# Altium schematic sheet MotorSheet.SchDoc
size A; SheetNumber: 2; SheetTotal: 4
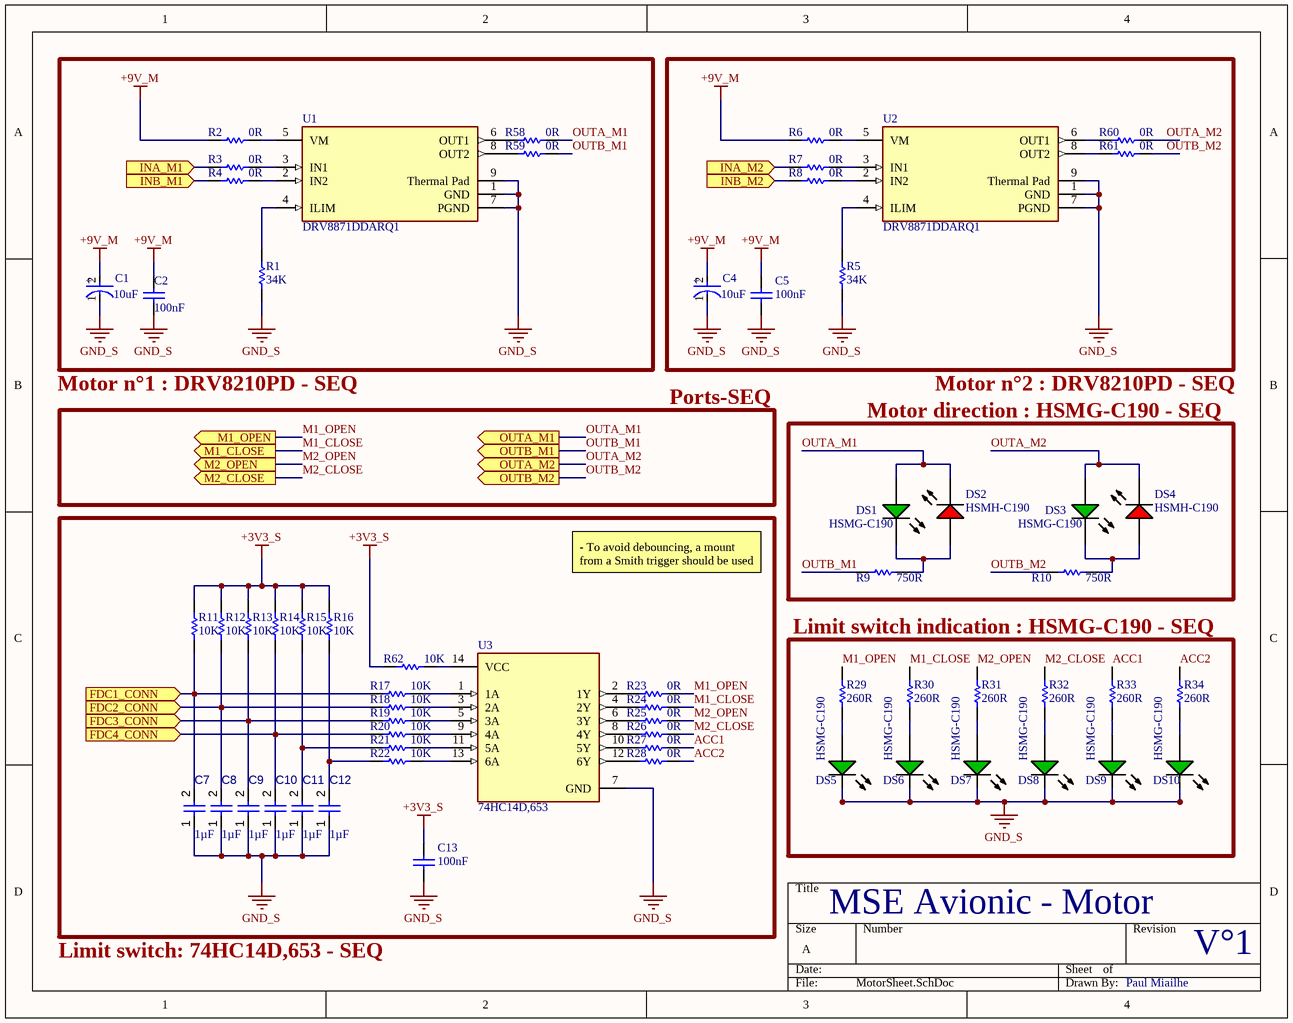
[diagram p0: MotorSheet.SchDoc]

## Parts
C1  Capacitance: 10uF  [FP-SC-MFG]  (hidden comment: EEE1VA100SR)
C2  Capacitance: 100nF  [CAPC2013X135X45ML10T25]  (hidden comment: GRM21BR71H104KA01L)
C4  Capacitance: 10uF  [FP-SC-MFG]  (hidden comment: EEE1VA100SR)
C5  Capacitance: 100nF  [CAPC2013X135X45ML10T25]  (hidden comment: GRM21BR71H104KA01L)
C7  value 1µF  [CAPC0603(1608)100_L]  (hidden comment: Capacitor 1µF +/-0.1% 25V 0603)
C8  value 1µF  [CAPC0603(1608)100_L]  (hidden comment: Capacitor 1µF +/-0.1% 25V 0603)
C9  value 1µF  [CAPC0603(1608)100_L]  (hidden comment: Capacitor 1µF +/-0.1% 25V 0603)
C10  value 1µF  [CAPC0603(1608)100_L]  (hidden comment: Capacitor 1µF +/-0.1% 25V 0603)
C11  value 1µF  [CAPC0603(1608)100_L]  (hidden comment: Capacitor 1µF +/-0.1% 25V 0603)
C12  value 1µF  [CAPC0603(1608)100_L]  (hidden comment: Capacitor 1µF +/-0.1% 25V 0603)
C13  Capacitance: 100nF  [CAPC2013X135X45ML10T25]  (hidden comment: GRM21BR71H104KA01L)
DS1  HSMG-C190  [AVAG-HSMX-C190_V]
DS2  HSMH-C190  [AVAG-HSMX-C190_V]
DS3  HSMG-C190  [AVAG-HSMX-C190_V]
DS4  HSMH-C190  [AVAG-HSMX-C190_V]
DS5  HSMG-C190  [AVAG-HSMX-C190_V]
DS6  HSMG-C190  [AVAG-HSMX-C190_V]
DS7  HSMG-C190  [AVAG-HSMX-C190_V]
DS8  HSMG-C190  [AVAG-HSMX-C190_V]
DS9  HSMG-C190  [AVAG-HSMX-C190_V]
DS10  HSMG-C190  [AVAG-HSMX-C190_V]
R1  Resistance: 34K  [RESC1608X55X25ML10T15]  (hidden comment: RC0603JR-070RL)
R2  Resistance: 0R  [RESC1608X55X25ML10T15]  (hidden comment: RC0603JR-070RL)
R3  Resistance: 0R  [RESC1608X55X25ML10T15]  (hidden comment: RC0603JR-070RL)
R4  Resistance: 0R  [RESC1608X55X25ML10T15]  (hidden comment: RC0603JR-070RL)
R5  Resistance: 34K  [RESC1608X55X25ML10T15]  (hidden comment: RC0603JR-070RL)
R6  Resistance: 0R  [RESC1608X55X25ML10T15]  (hidden comment: RC0603JR-070RL)
R7  Resistance: 0R  [RESC1608X55X25ML10T15]  (hidden comment: RC0603JR-070RL)
R8  Resistance: 0R  [RESC1608X55X25ML10T15]  (hidden comment: RC0603JR-070RL)
R9  Resistance: 750R  [RESC1608X55X30ML20T20]  (hidden comment: ERA-3AEB751V)
R10  Resistance: 750R  [RESC1608X55X30ML20T20]  (hidden comment: ERA-3AEB751V)
R11  Resistance: 10K  [RESC1609X55X30LL15T15]  (hidden comment: ERJ3EKF1002V)
R12  Resistance: 10K  [RESC1609X55X30LL15T15]  (hidden comment: ERJ3EKF1002V)
R13  Resistance: 10K  [RESC1609X55X30LL15T15]  (hidden comment: ERJ3EKF1002V)
R14  Resistance: 10K  [RESC1609X55X30LL15T15]  (hidden comment: ERJ3EKF1002V)
R15  Resistance: 10K  [RESC1609X55X30LL15T15]  (hidden comment: ERJ3EKF1002V)
R16  Resistance: 10K  [RESC1609X55X30LL15T15]  (hidden comment: ERJ3EKF1002V)
R17  Resistance: 10K  [RESC1609X55X30LL15T15]  (hidden comment: ERJ3EKF1002V)
R18  Resistance: 10K  [RESC1609X55X30LL15T15]  (hidden comment: ERJ3EKF1002V)
R19  Resistance: 10K  [RESC1609X55X30LL15T15]  (hidden comment: ERJ3EKF1002V)
R20  Resistance: 10K  [RESC1609X55X30LL15T15]  (hidden comment: ERJ3EKF1002V)
R21  Resistance: 10K  [RESC1609X55X30LL15T15]  (hidden comment: ERJ3EKF1002V)
R22  Resistance: 10K  [RESC1609X55X30LL15T15]  (hidden comment: ERJ3EKF1002V)
R23  Resistance: 0R  [RESC1608X55X25ML10T15]  (hidden comment: RC0603JR-070RL)
R24  Resistance: 0R  [RESC1608X55X25ML10T15]  (hidden comment: RC0603JR-070RL)
R25  Resistance: 0R  [RESC1608X55X25ML10T15]  (hidden comment: RC0603JR-070RL)
R26  Resistance: 0R  [RESC1608X55X25ML10T15]  (hidden comment: RC0603JR-070RL)
R27  Resistance: 0R  [RESC1608X55X25ML10T15]  (hidden comment: RC0603JR-070RL)
R28  Resistance: 0R  [RESC1608X55X25ML10T15]  (hidden comment: RC0603JR-070RL)
R29  260R  [RESC1609X50X30NL8T20]  (no BOM)
R30  260R  [RESC1609X50X30NL8T20]  (no BOM)
R31  260R  [RESC1609X50X30NL8T20]  (no BOM)
R32  260R  [RESC1609X50X30NL8T20]  (no BOM)
R33  260R  [RESC1609X50X30NL8T20]  (no BOM)
R34  260R  [RESC1609X50X30NL8T20]  (no BOM)
R58  Resistance: 0R  [RESC1608X55X25ML10T15]  (hidden comment: RC0603JR-070RL)
R59  Resistance: 0R  [RESC1608X55X25ML10T15]  (hidden comment: RC0603JR-070RL)
R60  Resistance: 0R  [RESC1608X55X25ML10T15]  (hidden comment: RC0603JR-070RL)
R61  Resistance: 0R  [RESC1608X55X25ML10T15]  (hidden comment: RC0603JR-070RL)
R62  Resistance: 10K  [RESC1609X55X30LL15T15]  (hidden comment: ERJ3EKF1002V)
U1  DRV8871DDARQ1  [FP-DDA0008E-IPC_A]
U2  DRV8871DDARQ1  [FP-DDA0008E-IPC_A]
U3  74HC14D,653  [FP-SOT108-1-MFG]

## Blocks framed on the sheet
Motor direction : HSMG-C190 - SEQ: DS1-DS4 R9 R10
Limit switch indication : HSMG-C190 - SEQ: DS5-DS10 R29-R34

## Ports
FDC1_CONN (in), FDC2_CONN (in), FDC3_CONN (in), FDC4_CONN (in), INA_M1 (in), INA_M2 (in), INB_M1 (in), INB_M2 (in), M1_CLOSE (out), M1_OPEN (out), M2_CLOSE (out), M2_OPEN (out), OUTA_M1 (out), OUTA_M2 (out), OUTB_M1 (out), OUTB_M2 (out)

## Nets
+3V3_S: C13.2 R11.2 R12.2 R13.2 R14.2 R15.2 R16.2 R62.2
+9V_M: C1.2(A) C2.2 C4.2(A) C5.2 R2.1 R6.1
GND_S: C1.1(C) C2.1 C4.1(C) C5.1 C7.1 C8.1 C9.1 C10.1 C11.1 C12.1 C13.1 DS5.2(K) DS6.2(K) DS7.2(K) DS8.2(K) DS9.2(K) DS10.2(K) R1.1 R5.1 U1.1(GND) U1.7(PGND) U1.9(Thermal_Pad) U2.1(GND) U2.7(PGND) U2.9(Thermal_Pad) U3.7(GND)
ACC1: R27.2 R33.1
ACC2: R28.2 R34.1
FDC1_CONN: C7.2 R11.1 R17.2 ; port FDC1_CONN
FDC2_CONN: C8.2 R12.1 R18.2 ; port FDC2_CONN
FDC3_CONN: C9.2 R13.1 R19.2 ; port FDC3_CONN
FDC4_CONN: C10.2 R14.1 R20.2 ; port FDC4_CONN
INA_M1: R3.1 ; port INA_M1
INA_M2: R7.1 ; port INA_M2
INB_M1: R4.1 ; port INB_M1
INB_M2: R8.1 ; port INB_M2
M1_CLOSE: R24.2 R30.1 ; port M1_CLOSE
M1_OPEN: R23.2 R29.1 ; port M1_OPEN
M2_CLOSE: R26.2 R32.1 ; port M2_CLOSE
M2_OPEN: R25.2 R31.1 ; port M2_OPEN
OUTA_M1: DS1.1(A) DS2.2(K) R58.2 ; port OUTA_M1
OUTA_M2: DS3.1(A) DS4.2(K) R60.2 ; port OUTA_M2
OUTB_M1: R9.1 R59.2 ; port OUTB_M1
OUTB_M2: R10.1 R61.2 ; port OUTB_M2
NetC11_2: C11.2 R15.1 R21.2
NetC12_2: C12.2 R16.1 R22.2
NetDS1_2: DS1.2(K) DS2.1(A) R9.2
NetDS3_2: DS3.2(K) DS4.1(A) R10.2
NetDS5_1: DS5.1(A) R29.2
NetDS6_1: DS6.1(A) R30.2
NetDS7_1: DS7.1(A) R31.2
NetDS8_1: DS8.1(A) R32.2
NetDS9_1: DS9.1(A) R33.2
NetDS10_1: DS10.1(A) R34.2
NetR1_2: R1.2 U1.4(ILIM)
NetR2_2: R2.2 U1.5(VM)
NetR3_2: R3.2 U1.3(IN1)
NetR4_2: R4.2 U1.2(IN2)
NetR5_2: R5.2 U2.4(ILIM)
NetR6_2: R6.2 U2.5(VM)
NetR7_2: R7.2 U2.3(IN1)
NetR8_2: R8.2 U2.2(IN2)
NetR17_1: R17.1 U3.1(1A)
NetR18_1: R18.1 U3.3(2A)
NetR19_1: R19.1 U3.5(3A)
NetR20_1: R20.1 U3.9(4A)
NetR21_1: R21.1 U3.11(5A)
NetR22_1: R22.1 U3.13(6A)
NetR23_1: R23.1 U3.2(1Y)
NetR24_1: R24.1 U3.4(2Y)
NetR25_1: R25.1 U3.6(3Y)
NetR26_1: R26.1 U3.8(4Y)
NetR27_1: R27.1 U3.10(5Y)
NetR28_1: R28.1 U3.12(6Y)
NetR58_1: R58.1 U1.6(OUT1)
NetR59_1: R59.1 U1.8(OUT2)
NetR60_1: R60.1 U2.6(OUT1)
NetR61_1: R61.1 U2.8(OUT2)
NetR62_1: R62.1 U3.14(VCC)

## Notes on the sheet
- Motor n°1 : DRV8210PD - SEQ
- Ports-SEQ
- Motor n°2 : DRV8210PD - SEQ
- - To avoid debouncing, a mount from a Smith trigger should be used
- Limit switch: 74HC14D,653 - SEQ
- MSE Avionic - Motor
- V°1
- Paul Miailhe
- (in symbol CMP-05427-000087-1) +

## Library data of the parts
C1 C4 = CMP-05427-000087-1: CAP ALUM 10UF 20% 35V SMD; Life (Hours): 2000Hour; Lead Length: 2.2mm; Ripple Current (AC): 30mA; Leakage Current: 3uA; Length: 5.5mm; Construction: Cylindrical; Diameter: 5mm; RoHS Compliant: Yes; REACH SVHC: No SVHC; Max Operating Temperature: 85°C; Series: S; Case/Package: Radial; Contact Plating: Tin; Packaging: Tape and Reel; Voltage Rating: 35V; Number of Pins: 2; Height: 5.4mm; Width: 5.3mm; Voltage Rating (DC): 35V; Mount: Surface Mount; Tolerance: 20%; Lead Pitch: 1.5mm; Radiation Hardening: No; Height - Seated (Max): 0.213inch; Ripple Current: 30mA; Voltage: 35V; Package Quantity: 1; Termination: SMD/SMT; Min Operating Temperature: -40°C
C2 C5 C13 = CMP-2100-03644-1: Chip Capacitor, 0.1 uF, +/- 10%, 50 V, -55 to 125 degC, 0805 (2012 Metric), RoHS, Tape and Reel; Manufacturer: Murata; Voltage: 50V; Insulation Resistance: 10GR; Dielectric Material: Ceramic; Dielectric: X7R; Package Description: 2-Pin Surface Mount Device, Body 2 x 1.25 mm; Manufacturer URL: http://www.murata.com/; Case Code (Imperial): 0805; Datasheet URL: http://psearch.en.murata.com/capacitor/product/GRM21BR71H104KA01%23.pdf; Termination: SMD/SMT; Lead Free: LeadFree; Package Quantity: 1; Mount: SurfaceMount; REACH SVHC: Unknown; Thickness: 0.053inch; Height: 1.25mm; Case/Package: 0805; Voltage Rating: 50V; Width: 0.049inch; Case Code (Metric): 2012; Material: Ceramic; Min Operating Temperature: -55degC; RoHSCompliant: true; Datasheet Version: 42675.0; Voltage Rating (DC): 50V; Tolerance: 10%; Package Reference: 0805; Depth: 1.25mm; Length: 2mm; Max Operating Temperature: 125degC; Packaging: TapeandReel; Number of Pins: 2; Radiation Hardening: No
C7-C12 = CMP-001-00055-4: Chip Capacitor, 1µF +/-0.1%, 25V, 0603, Thickness 1 mm; Tolerance: 20%; Min Operating Temperature: -55°C; Max Operating Temperature: 85°C; Voltage Rating: 25V; Mounting Technology: SMT; Case/Package: 0603; Pins: 2
DS1 DS3 DS5-DS10 = CMP-1744-00002-1: Chip LED, Green, 2.2 V, -40 to 85 degC, 2-Pin SMD, RoHS, Tape and Reel; Frequency: 400 KHz; Max Supply Voltage: 5.5 V; Access Time: 3500 ns; Clock Frequency: 100 KHz; Case\Package: SOIC; Density: 32 kb; Nominal Supply Current: 2 mA; Interface: Serial; Min Supply Voltage: 1.7 V; Packaging: Tape and Reel; PackageReference: HSMX-C190; ComponentLink2URL: http://docs.avagotech.com/docs/AV02-0551EN; RoHSCompliant: true; Pins: 8; REACH SVHC: No SVHC; Max Operating Temperature: 85 degC; Width: 4 mm; Radiation Hardening: No; Package Quantity: 3000; ComponentLink3Description: Package Specification; ComponentLink1Description: Manufacturer URL; Min Operating Temperature: -40 degC; PackageDescription: 2-Pin Surface Mount Device, Body 1.6 x 0.8 mm, Height 0.9 mm; Max Clock Frequency: 100 KHz; Height: 1.5 mm; ComponentLink1URL: http://www.avagotech.com/; DatasheetVersion: Mar-12; ComponentLink2Description: Datasheet; Mount: Surface Mount; Length: 5 mm; ComponentLink3URL: http://www.fairchildsemi.com/dwg/MA/MA03D.pdf
DS2 DS4 = CMP-1744-00004-1: LED Uni-Color Red, 65 mW, 20 mA, -40 to 85 degC, 2-Pin SMD, RoHS, Tape and Reel; Connector Type: USB; Gender: Male; Current Rating: 1 A; Length: 7.5 mm; Lead Pitch: 0.65 mm; PackageReference: HSMX-C190; Package Quantity: 2000; Max Operating Temperature: 85 degC; PackageDescription: 2-Pin Surface Mount Device, Body 1.6 x 0.8 mm, Height 0.9 mm; ComponentLink3Description: Package Specification; Mount: Surface Mount; Min Operating Temperature: -30 degC; ComponentLink3URL: http://www.fairchildsemi.com/dwg/MA/MA03D.pdf; ComponentLink1Description: Manufacturer URL; Contact Material: Copper; Pins: 5; Width: 5.6 mm; ComponentLink2Description: Datasheet; RoHSCompliant: true; DatasheetVersion: Mar-12; Height: 2.8 mm; Packaging: Tape and Reel; Contact Plating: Gold; ComponentLink1URL: http://www.avagotech.com/; REACH SVHC: No SVHC; ComponentLink2URL: http://docs.avagotech.com/docs/AV02-0551EN
R1-R8 R23-R28 R58-R61 = CMP-2100-03667-1: Chip Resistor, 0 Ohm, +/- 5%, 0.1 W, -55 to 155 degC, 0603 (1608 Metric), RoHS, Tape and Reel; Manufacturer: Yageo; Temperature Coefficient: 200ppm/degreesC; Voltage Rating: 50V; Power Rating: 100mW; Width: 0.8mm; Max Operating Temperature: 155degC; Tolerance: 5%; Package Reference: 0603; Height: 0.45mm; Depth: 0.8mm; Package Description: 2-Pin Surface Mount Device, Body 1.6 x 0.8 mm; Termination: SMD/SMT; Package Quantity: 5000; Case/Package: 0603; Case Code (Imperial): 0603; Radiation Hardening: No; Number of Pins: 2; Length: 1.6mm; Lead Free: LeadFree; Voltage Rating (DC): 50V; Military Standard: Not; Datasheet URL: http://www.yageo.com/NewPortal/yageodocoutput?fileName=/pdf/R-Chip/PYu-RC_Group_51_RoHS_L_5.pdf; Manufacturer URL: http://www.yageo.com/; Packaging: TapeandReel; Case Code (Metric): 1608; Min Operating Temperature: -55degC; Composition: ThickFilm; RoHSCompliant: true; Contact Plating: Tin; Datasheet Version: Rev. 5, 10/2016; REACH SVHC: NoSVHC
R9 R10 = CMP-2000-00122-1: Manufacturer: Panasonic; Tolerance: 0.1%; Power Rating: 100mW; Voltage Rating: 75V; Temperature Coefficient: 25ppm/°C; Part Number: ERA-3AEB751V; Supplier 1: RSComponents; Supplier Part Number 1: 6621117; Manufacturer Part Number: ERA-3AEB751V; RoHS: Yes; Category: Chip SMD Resistors; Stock 1: 1; Pricing 1: 5=0.80100, 50=0.74600, 100=0.69900, 250=0.64900, 500=0.59400 (USD); Mount: Surface Mount; Case/Package: 0603; Number of Pins: 2; Case Code (Metric): 1608; Case Code (Imperial): 0603; Contact Plating: Tin; Min Operating Temperature: -55°C; Max Operating Temperature: 155°C; Packaging: Cut Tape; Resistor Type: Thin Film; Package Quantity: 1; Number of Terminations: 2; Termination: SMD/SMT; Max Power Dissipation: 100mW; Voltage Rating (DC): 75V; Series: ERA-3A; Features: Automotive AEC-Q200; Resistance Tolerance: 0.1%; Construction: Rectangular; Technology: THIN FILM; Length: 1.6mm; Width: 0.8mm; Height: 0.45mm; Depth: 0.8mm; Radiation Hardening: No; REACH SVHC: No SVHC; RoHS Compliant: Yes; Lead Free: Lead Free; Military Standard: Not; ComponentLink1URL: https://datasheet.ciiva.com/11808/0900766b80fe20f7-11808070.pdf?src-supplier=RSComponents; ComponentLink1Description: https://datasheet.ciiva.com/11808/0900766b80fe20f7-11808070.pdf?src-supplier=RSComponents; ComponentLink2URL: https://datasheet.ciiva.com/29183/450701-da-01-en-widerstand-0603-era-29183748.pdf?src-supplier=Conrad; ComponentLink2Description: https://datasheet.ciiva.com/29183/450701-da-01-en-widerstand-0603-era-29183748.pdf?src-supplier=Conrad; ComponentLink3URL: https://datasheet.ciiva.com/48530/era-eng-tds-48530518.pdf?src-supplier=Distrelec; ComponentLink3Description: https://datasheet.ciiva.com/48530/era-eng-tds-48530518.pdf?src-supplier=Distrelec; ComponentLink4URL: https://datasheet.ciiva.com/7710/485442-7710616.pdf?src-supplier=Element14; ComponentLink4Description: https://datasheet.ciiva.com/7710/485442-7710616.pdf?src-supplier=Element14; ComponentLink5URL: https://datasheet.ciiva.com/7710/485442-7710617.pdf?src-supplier=Element14; ComponentLink5Description: https://datasheet.ciiva.com/7710/485442-7710617.pdf?src-supplier=Element14; ComponentLink6URL: https://datasheet.ciiva.com/7710/485442-7710618.pdf?src-supplier=Element14; ComponentLink6Description: https://datasheet.ciiva.com/7710/485442-7710618.pdf?src-supplier=Element14; ComponentLink7URL: https://datasheet.ciiva.com/30081/54aoa0000ce26-30081771.pdf?src-supplier=Onlinecomponents.com; ComponentLink7Description: https://datasheet.ciiva.com/30081/54aoa0000ce26-30081771.pdf?src-supplier=Onlinecomponents.com; ComponentLink8URL: https://datasheet.ciiva.com/22740/485442-22740940.pdf?src-supplier=Element14; ComponentLink8Description: https://datasheet.ciiva.com/22740/485442-22740940.pdf?src-supplier=Element14; ComponentLink9URL: https://datasheet.ciiva.com/9180/aoa0000ce26-9180142.pdf?src-supplier=Avnet; ComponentLink9Description: https://datasheet.ciiva.com/9180/aoa0000ce26-9180142.pdf?src-supplier=Avnet
R11-R22 R62 = CMP-1012-00623-3: Chip Resistor, 10 KOhm, +/- 1%, 0.1 W, -55 to 155 degC, 0603 (1608 Metric), RoHS, Tape and Reel; Manufacturer: Panasonic; Voltage Rating: 75V; Case\/Package: 0603; Power Rating: 100mW; Temperature Coefficient: 100ppm\/degreesC; Number of Pins: 2; Package Reference: 603; Depth: 0.8mm; Mount: SurfaceMount; Package Description: 2-Pin Surface Mount Device, Body 1.6 x 0.85 mm; Datasheet Version: 02/2017; Length: 1.6mm; Lead Free: LeadFree; Height: 0.45mm; Number of Terminations: 2; Max Power Dissipation: 100mW; Min Operating Temperature: -55degC; Datasheet URL: https://industrial.panasonic.com/cdbs/www-data/pdf/RDA0000/AOA0000C304.pdf; Termination: SMD/SMT; Case Code (Metric): 1608; Case Code (Imperial): 0603; Tolerance: 1%; Max Operating Temperature: 155degC; RoHSCompliant: true; Voltage Rating (DC): 75V; Radiation Hardening: No; Packaging: TapeandReel; Composition: ThickFilm; Mounting Technology: SurfaceMount; Manufacturer URL: http://www.panasonic.com/; Width: 0.031inch; REACH SVHC: NoSVHC; Contact Plating: Tin; Military Standard: Not; Package Quantity: 1
R29-R34 = CMP-2000-03816-5: Manufacturer: Vishay Semiconductor; Voltage Rating: 75 V; Package Quantity: 5000; DatasheetVersion: 06/2012; Min Operating Temperature: -55 degC; ComponentLink1URL: http://www.vishay.com/; Mounting Technology: Surface Mount; Height: 0.45 mm; ComponentLink1Description: Manufacturer URL; REACH SVHC: Unknown; PackageReference: 0603; Packaging: Tape and Reel; Max Operating Temperature: 155 degC; Mount: Surface Mount; ComponentLink2Description: Datasheet; PackageDescription: 2-Pin Surface Mount Device, Body 1.575 x 0.85 mm; Length: 1.55 mm; ComponentLink2URL: http://www.vishay.com/docs/20035/dcrcwe3.pdf; Pins: 2; RoHSCompliant: true
U1 U2 = CMP-04915-000023-1: IC MOTOR DRVR UNIPLR 8SO PWRPAD; Output Current: 3.6A; Interface: PWM; Logic Function: AND GATE; Min Operating Temperature: -40°C; Mount: Surface Mount; Number of Pins: 8; Max Operating Temperature: 125°C; Packaging: Cut Tape
U3 = CMP-14350-000004-1: IC INVERTER SCHMITT 6CH 14SO